# Altium project PS_Filter.PrjPcb
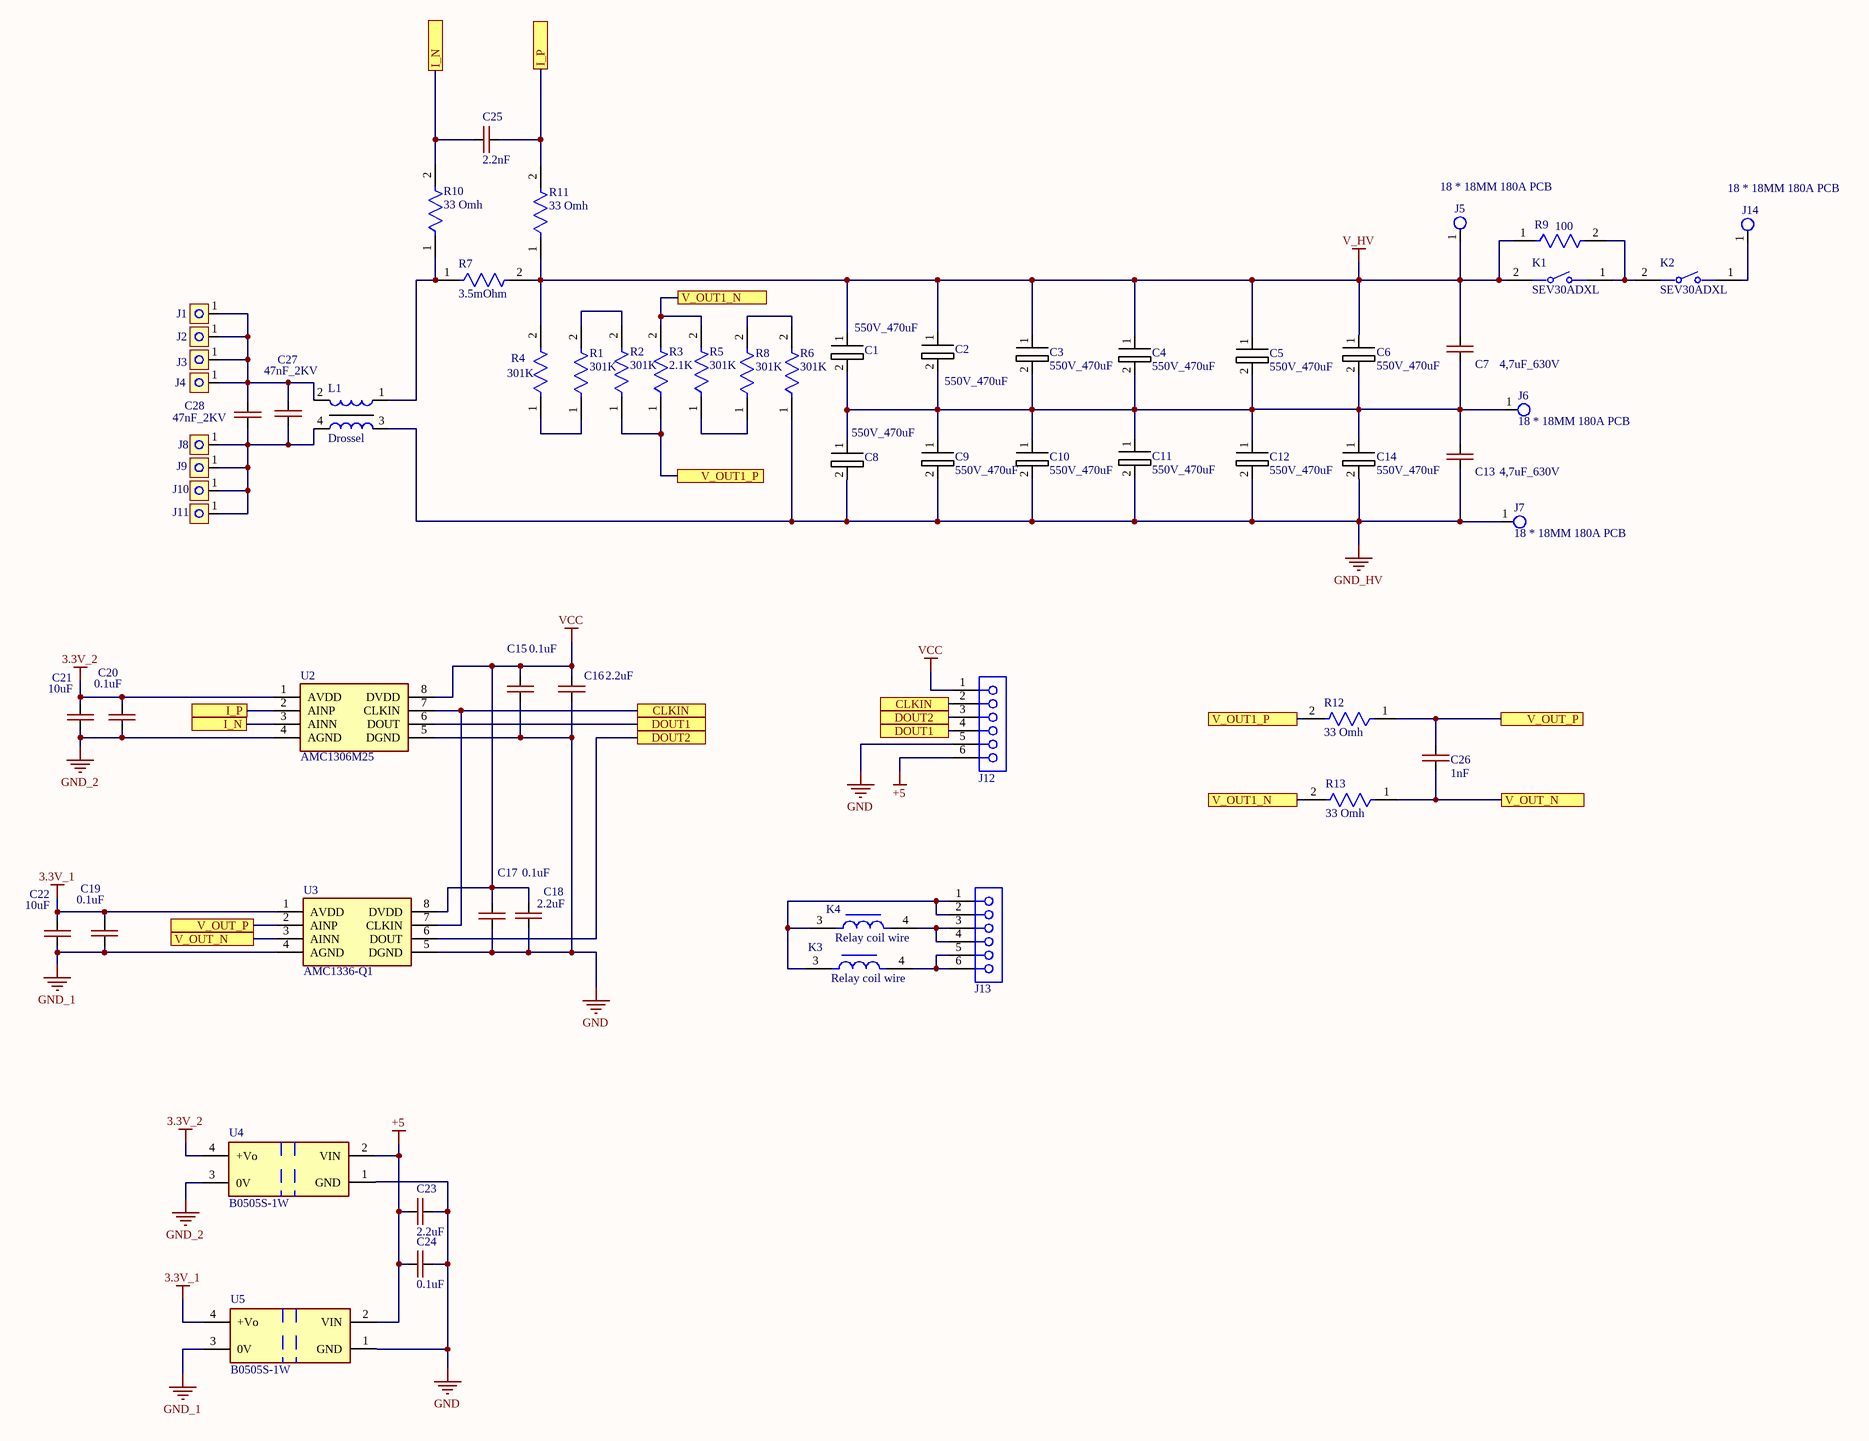
[diagram p0: PS_Filter.SchDoc]
1 sheet, 64 parts. Net scope: flat (ports and power ports of the same name join across sheets).
Board file: PS_Filter.PcbDoc

## Sheet PS_Filter.SchDoc
size 599 x 400 mm; SheetNumber: 1; SheetTotal: 1; SPICEModelCacheBTRAQOWF: <root> / <DocumentId>BTRAQOWF</DocumentId> / </root>

### Parts
C1  550V_470uF  [500V_470uF]
C2  550V_470uF  [500V_470uF]
C3  550V_470uF  [500V_470uF]
C4  550V_470uF  [500V_470uF]
C5  550V_470uF  [500V_470uF]
C6  550V_470uF  [500V_470uF]
C7  4,7uF_630V  [CAP_4.7uF_630V]
C8  550V_470uF  [500V_470uF]
C9  550V_470uF  [500V_470uF]
C10  550V_470uF  [500V_470uF]
C11  550V_470uF  [500V_470uF]
C12  550V_470uF  [500V_470uF]
C13  4,7uF_630V  [CAP_4.7uF_630V]
C14  550V_470uF  [500V_470uF]
C15  0.1uF  [CAP-0603]
C16  2.2uF  [CAP-0603]
C17  0.1uF  [CAP-0603]
C18  2.2uF  [CAP-0603]
C19  0.1uF  [CAP-0603]
C20  0.1uF  [CAP-0603]
C21  10uF  [CAP-0603]
C22  10uF  [CAP-0603]
C23  2.2uF  [CAP-0603]
C24  0.1uF  [CAP-0603]
C25  2.2nF  [CAP-0603]
C26  1nF  [CAP-0603]
C27  47nF_2KV  [47nF_2kV]
C28  47nF_2KV  [47nF_2kV]
J1  KF136HT-10.16  [Conn_MEIGAN_MG136HT]  (value not drawn)
J2  KF136HT-10.16  [Conn_MEIGAN_MG136HT]  (value not drawn)
J3  KF136HT-10.16  [Conn_MEIGAN_MG136HT]  (value not drawn)
J4  KF136HT-10.16  [Conn_MEIGAN_MG136HT]  (value not drawn)
J5  18 * 18MM 180A PCB  [M8 Conn]
J6  18 * 18MM 180A PCB  [M8 Conn]
J7  18 * 18MM 180A PCB  [M8 Conn]
J8  KF136HT-10.16  [Conn_MEIGAN_MG136HT]  (value not drawn)
J9  KF136HT-10.16  [Conn_MEIGAN_MG136HT]  (value not drawn)
J10  KF136HT-10.16  [Conn_MEIGAN_MG136HT]  (value not drawn)
J11  KF136HT-10.16  [Conn_MEIGAN_MG136HT]  (value not drawn)
J12  61300611821  [61300611821]  (value not drawn)
J13  61300611821  [61300611821]  (value not drawn)
J14  18 * 18MM 180A PCB  [M8 Conn]
K1  SEV30ADXL  [Relay_1000VDC_30A]
K2  SEV30ADXL  [Relay_1000VDC_30A]
K3  Relay coil wire  [Relay_Coil]
K4  Relay coil wire  [Relay_Coil]
L1  Drossel  [T47x27x15]
R1  301K  [RES-2512]
R2  301K  [RES-2512]
R3  2.1K  [RES-2512]
R4  301K  [RES-2512]
R5  301K  [RES-2512]
R6  301K  [RES-2512]
R7  3.5mOhm  [RES-3921]
R8  301K  [RES-2512]
R9  100  [RES_100W_Aluminium]
R10  33 Omh  [RES-0603]
R11  33 Omh  [RES-0603]
R12  33 Omh  [RES-0603]
R13  33 Omh  [RES-0603]
U2  AMC1306M25  [FP-DWV0008A-MFG]
U3  AMC1336-Q1  [FP-DWV0008A-MFG]
U4  B0505S-1W  [B0505S-1W]
U5  B0505S-1W  [B0505S-1W]

### Ports
CLKIN, DOUT1, DOUT2, I_N, I_P, V_OUT1_N, V_OUT1_P, V_OUT_N, V_OUT_P

### Nets
3.3V_1: C19.1 C22.1 U3.1(AVDD) U5.4(+Vo)
3.3V_2: C20.1 C21.1 U2.1(AVDD) U4.4(+Vo)
+5: C23.1 C24.1 J12.6 U4.2(VIN) U5.2(VIN)
GND: C15.2 C16.2 C17.2 C18.2 C23.2 C24.2 J12.5 U2.5(DGND) U3.5(DGND) U4.1(GND) U5.1(GND)
GND_1: C19.2 C22.2 U3.4(AGND) U5.3(0V)
GND_2: C20.2 C21.2 U2.4(AGND) U4.3(0V)
GND_HV: C8.2 C9.2 C10.2 C11.2 C12.2 C13.1 C14.2 J7.1 L1.3 R6.1
V_HV: C1.1 C2.1 C3.1 C4.1 C5.1 C6.1 C7.2 J5.1 K1.2 R4.2 R7.2 R9.1 R11.1
VCC: C15.1 C16.1 C17.1 C18.1 J12.1 U2.8(DVDD) U3.8(DVDD)
NetC1_2: C1.2 C2.2 C3.2 C4.2 C5.2 C6.2 C7.1 C8.1 C9.1 C10.1 C11.1 C12.1 C13.2 C14.1 J6.1
NetC25_1: C25.1 R10.2 U2.3(AINN) ; port I_N
NetC25_2: C25.2 R11.2 U2.2(AINP) ; port I_P
NetC26_1: C26.1 R12.1 U3.2(AINP) ; port V_OUT_P
NetC26_2: C26.2 R13.1 U3.3(AINN) ; port V_OUT_N
NetC27_1: C27.1 C28.1 J8.1 J9.1 J10.1 J11.1 L1.4
NetC27_2: C27.2 C28.2 J1.1 J2.1 J3.1 J4.1 L1.2
NetJ12_2: J12.2 U2.7(CLKIN) U3.7(CLKIN) ; port CLKIN
NetJ12_3: J12.3 U3.6(DOUT) ; port DOUT2
NetJ12_4: J12.4 U2.6(DOUT) ; port DOUT1
NetJ13_1: J13.1 J13.2 K3.3 K4.3
NetJ13_3: J13.3 J13.4 K4.4
NetJ13_5: J13.5 J13.6 K3.4
NetJ14_1: J14.1 K2.1
NetK1_1: K1.1 K2.2 R9.2
NetL1_1: L1.1 R7.1 R10.1
NetR1_1: R1.1 R4.1
NetR1_2: R1.2 R2.2
NetR2_1: R2.1 R3.1 R12.2 ; port V_OUT1_P
NetR3_2: R3.2 R5.2 R13.2 ; port V_OUT1_N
NetR5_1: R5.1 R8.1
NetR6_2: R6.2 R8.2

### Library data of the parts
C1-C6 C8-C12 C14 = CAP_POL_LOW_IMP
C7 C13 C15-C26 = CAP-NON-POLAR
C27 C28 = CAP-V
J1-J4 J8-J11 = Connector_MEIGAN_MG136HT
J5-J7 J14 = Klema_15_A: 18 * 18MM 180A PCB High Current Solder Terminal Copper Terminal Fastener M8 Nut
J12 J13 = 61300611821: WR-PHD Socket Header, THT, Vertical, pitch 2.54mm, 1 Row, 6P; Manufacturer: Wurth Elektronik; Contact Resistance: 20mOhm; Rated Current: 3A; Working Voltage: 250V; Withstanding Voltage: 500V; Manufacturer Part Number: 61300611821; Category: Board-to-Board Connectors; Match Code: WR-PHD; ComponentLink1Description: Website Link; ComponentLink1URL: https://www.we-online.com/redexpert/article/61300611821?ad; ComponentLink2Description: Datasheet Link; ComponentLink2URL: https://www.we-online.com/redexpert/spec/61300611821?ad; Mount: Through Hole; Operating Temperature Max: 125°C; Operating Temperature Min: -40°C; Packaging: Tray; Gender: Socket Header; Number of Pins: 6; Number of Rows: 1; Orientation: Vertical; Pitch: 2.54mm
K1 K2 = Relay: 5-1000V 30A DC Contactor Power Relay SEV30ADXL Coil 12V
K3 K4 = Coil_relay
L1 = Drossel_Synphaze
R1 R2 R4-R6 R8 = RES-CONST: 301K   0.1%
R3 = RES-CONST: 2.1K   0.1%
R7 = RES-CONST: 3.5mOhm 1%  3920
R9 = RES-CONST: 100W RX24 Aluminum Power Metal Shell Case Wirewound Resistor 100Omh
R10-R13 = RES-CONST
U3 = AMC1336